# Altium schematic sheet IMU.SchDoc
size A4; SheetNumber: 2; SheetTotal: 3
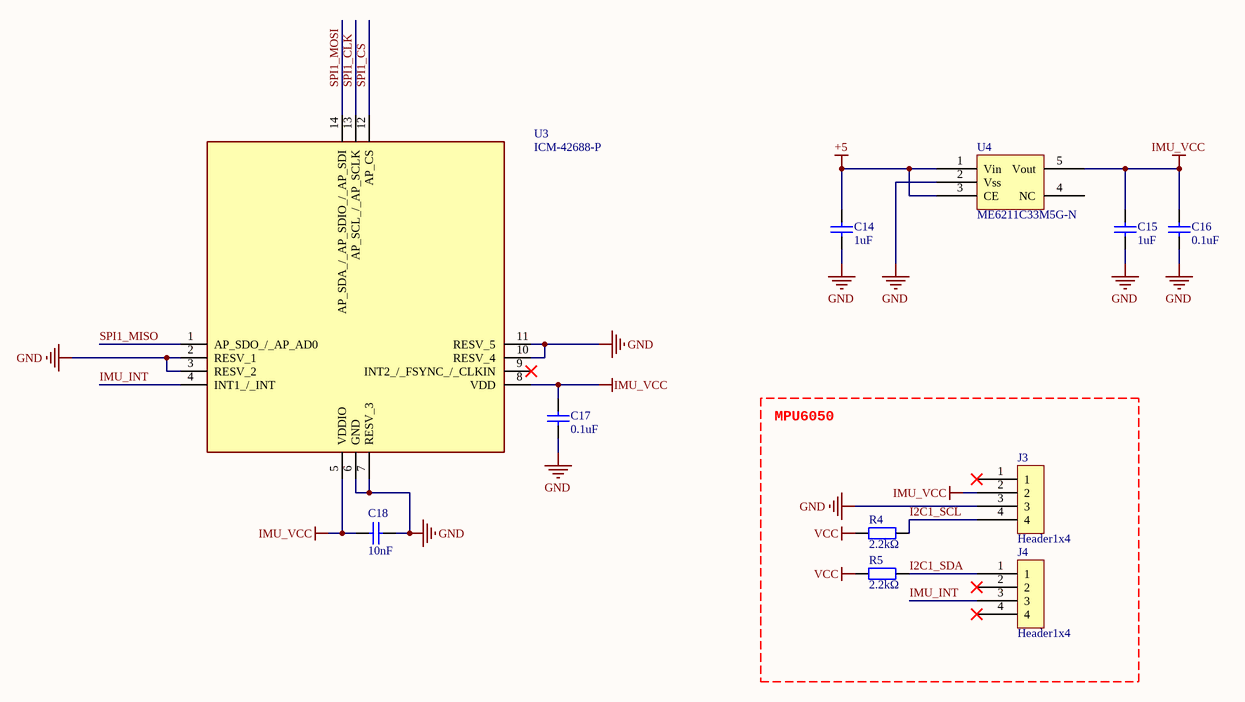
[diagram p0: IMU.SchDoc]

## Parts
C14  1uF  [C0603]
C15  1uF  [C0603]
C16  0.1uF  [C0603]
C17  0.1uF  [C0603]
C18  10nF  [C0603]
J3  Header1x4  [Header 1x4p]
J4  Header1x4  [Header 1x4p]
R4  2.2kΩ  [R0603]
R5  2.2kΩ  [R0603]
U3  ICM-42688-P  [IIM42352]
U4  ME6211C33M5G-N  [SOT-23-5]

## Blocks framed on the sheet
MPU6050: J3 J4 R4 R5

## Nets
+5: C14.2 U4.1(Vin) U4.3(CE)
GND: C14.1 C15.1 C16.1 C17.1 C18.1 J3.3 U3.2(RESV_1) U3.3(RESV_2) U3.6(GND) U3.7(RESV_3) U3.10(RESV_4) U3.11(RESV_5) U4.2(Vss)
IMU_VCC: C15.2 C16.2 C17.2 C18.2 J3.2 U3.5(VDDIO) U3.8(VDD) U4.5(Vout)
VCC: R4.2 R5.2
I2C1_SCL: J3.4 R4.1
I2C1_SDA: J4.1 R5.1
IMU_INT: J4.3 U3.4(INT1_/_INT)
SPI1_CLK: U3.13(AP_SCL_/_AP_SCLK)
SPI1_CS: U3.12(AP_CS)
SPI1_MISO: U3.1(AP_SDO_/_AP_AD0)
SPI1_MOSI: U3.14(AP_SDA_/_AP_SDIO_/_AP_SDI)

Not connected (* = marked no-connect by the designer): J3 1*; J4 2* 4*; U3 9(INT2_/_FSYNC_/_CLKIN)*; U4 4(NC)

## Library data of the parts
C14-C18 = Capacitor
R4 R5 = Resistor
U3 = ICM-42688-P: Integrated Circuit; Manufacturer_Name: TDK; Datasheet Link: https://3cfeqx1hf82y3xcoull08ihx-wpengine.netdna-ssl.com/wp-content/uploads/2021/06/DS-000347-ICM-42688-P-v1.5.pdf; Manufacturer_Part_Number: ICM-42688-P; Mouser Part Number: 410-ICM-42688-P; Mouser Price/Stock: https://www.mouser.co.uk/ProductDetail/TDK-InvenSense/ICM-42688-P?qs=OlC7AqGiEDk8QrNAV728zw%3D%3D; Arrow Part Number: ICM-42688-P; Arrow Price/Stock: https://www.arrow.com/en/products/icm-42688-p/invensense?region=nac
U4 = ME6211C33M5G-N: C82942